# EAGLE schematic schematic_square_wave_oscillator (EAGLE 9.3.1)
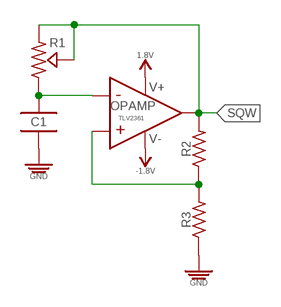
[diagram p0: schematic, sheet 1]

## Parts
C1  0.1uF/50V  0.1UF_SMD-0402_50V-10%  [CAPC1005X55_SMD-0402]
OPAMP  TLV2361_GP_20MA_7MHZ  [SOT95P280X145-5]
R1  100K  POTENTIOMETER_ST4ETB104_100K-1/4W-20%  [POTENTIOMETER_SQ-L5-W4.5-H2.3]
R2  10K  10KΩ_SMD-0402_1/16W-5%  [RESC1005X35_SMD-0402]
R3  10K  10KΩ_SMD-0402_1/16W-5%  [RESC1005X35_SMD-0402]

## Nets
1.8V: OPAMP.5(V+)
-1.8V: OPAMP.2(V-)
GND [DGND]: C1.2 R3.1
N$138: OPAMP.1(IN+) R2.1 R3.2
N$139: C1.1 OPAMP.3(IN-) R1.3(CW)
SQW: OPAMP.4(OUT) R1.1(CCW) R1.2(S) R2.2

## Notes on the sheet
- TLV2361

## Library data of the parts
C1 = _capacitors:0.1UF; DATASHEET: https://product.tdk.com/info/en/catalog/datasheets/mlcc_commercial_soft_en.pdf; DIST: Digikey; DISTLINK: https://www.digikey.com/products/en?keywords=445-173610-1-ND; DISTPN: 445-173610-1-ND; MFR: TDK Corporation; MPN: C1005X7R1H104K050BE
OPAMP = _op_amps:TLV2361; DATASHEET: http://www.ti.com/lit/ds/symlink/tlv2361.pdf; DIST: Digikey; DISTLINK: https://www.digikey.com/products/en?keywords=296-13745-1-ND; DISTPN: 296-13745-1-ND; MFR: Texas Instruments; MPN: TLV2361IDBVR; VALUR: TLV2361
R1 = _resistors:POTENTIOMETER; DATASHEET: https://www.nidec-copal-electronics.com/e/catalog/trimmer/st-4.pdf; DIST: Digikey; DISTLINK: https://www.digikey.com/products/en?keywords=ST4ETB104CT-ND; DISTPN: ST4ETB104CT-ND; MFR: Nidec Copal Electronics; MPN: ST4ETB104
R2 R3 = _resistors:10KΩ; DATASHEET: http://www.yageo.com/NewPortal/yageodocoutput?fileName=/pdf/R-Chip/PYu-RC_51_RoHS_P_0.pdf; DIST: Digikey; DISTLINK: https://www.digikey.com/products/en?keywords=YAG1281CT-ND; DISTPN: YAG1281CT-ND; MFR: Yageo; MPN: RC0402JR-0710KP

## Net classes
4 DGND: width 0.152 mm